# EAGLE design main (EAGLE 5.09)
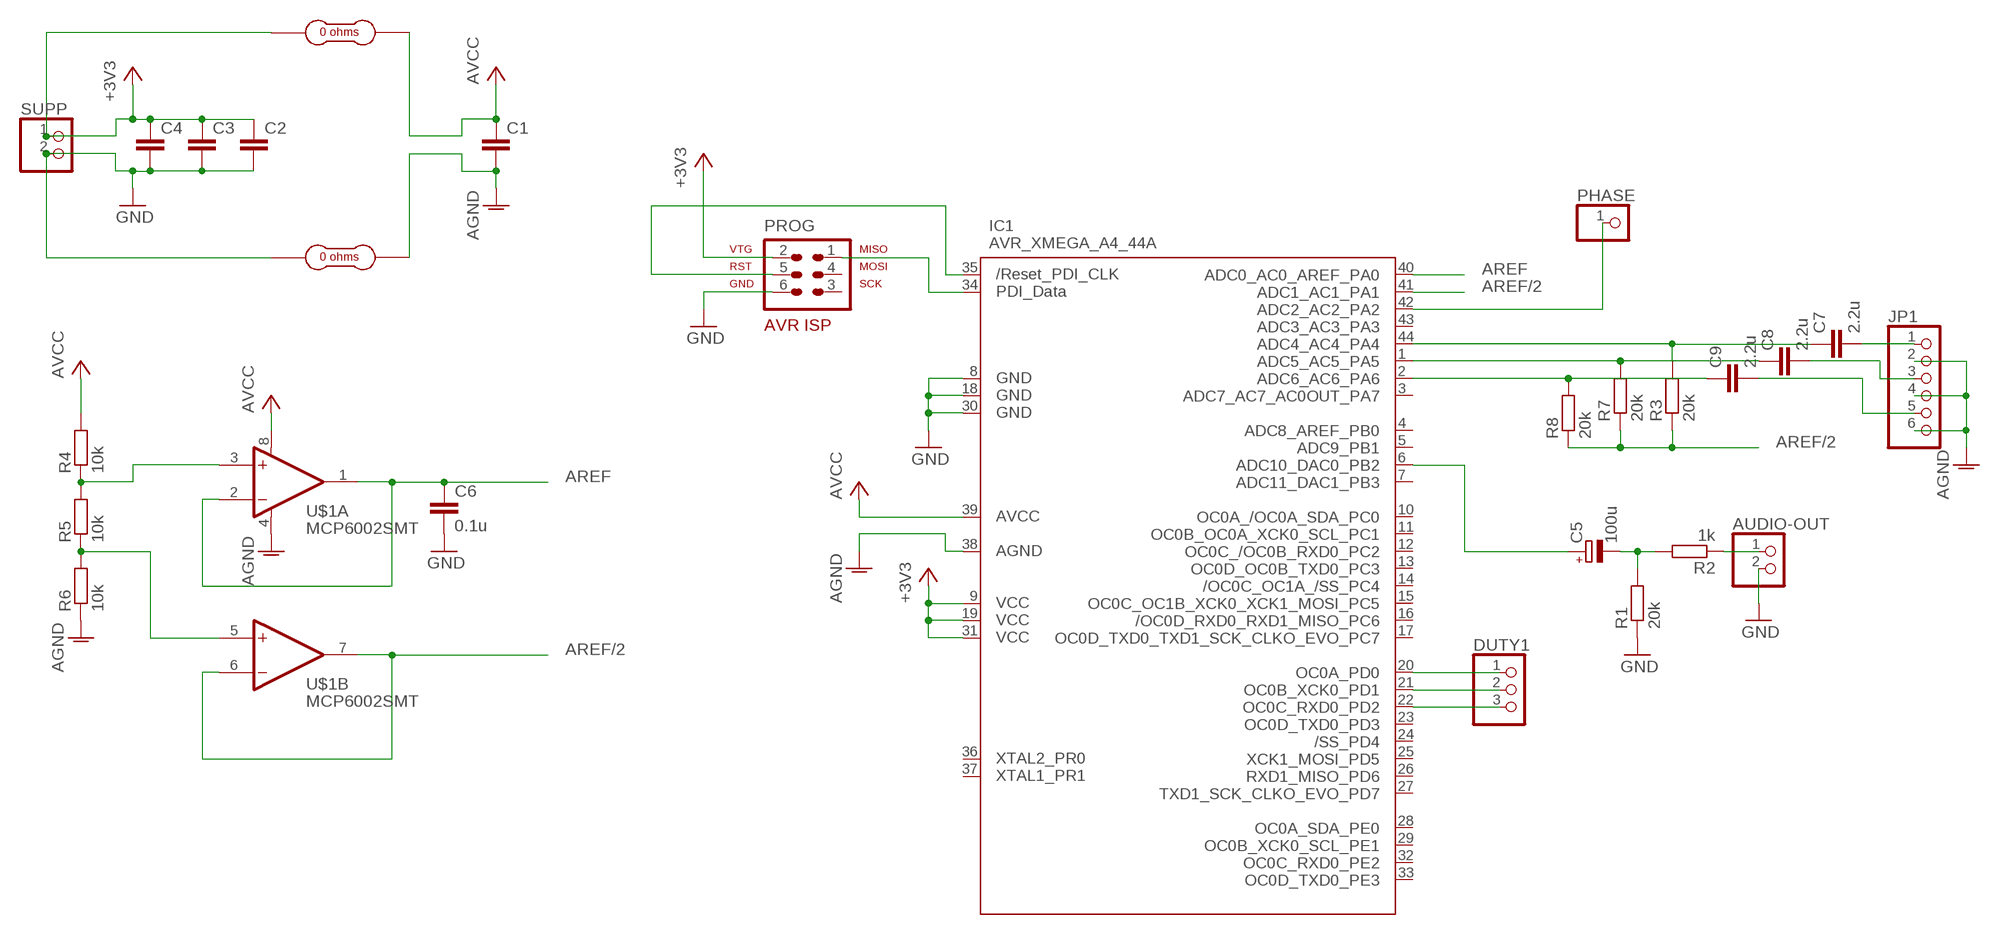
[diagram p0: schematic, sheet 1]

## Parts
AUDIO-OUT  PINHD-1X2  [1X02]
C1  C-EUC0805  [C0805]
C2  C-EUC0805  [C0805]
C3  C-EUC0805  [C0805]
C4  C-EUC0805  [C0805]
C5  100u  CPOL-EUE3.5-8  [E3,5-8]
C6  0.1u  C-EUC0805  [C0805]
C7  2.2u  C-EUC0805  [C0805]
C8  2.2u  C-EUC0805  [C0805]
C9  2.2u  C-EUC0805  [C0805]
DUTY1  PINHD-1X3  [1X03]
IC1  AVR_XMEGA_A4_44A  [TQFP44]
JP1  PINHD-1X6  [1X06]
PHASE  PINHD-1X1  [1X01]
PROG  AVR-ISP-6  [AVR-ISP-6]
R1  20k  R-EU_R0805  [R0805]
R2  1k  R-EU_R0805  [R0805]
R3  20k  R-EU_R0805  [R0805]
R4  10k  R-EU_R0805  [R0805]
R5  10k  R-EU_R0805  [R0805]
R6  10k  R-EU_R0805  [R0805]
R7  20k  R-EU_R0805  [R0805]
R8  20k  R-EU_R0805  [R0805]
SUPP  PINHD-1X2  [1X02]
U$1  MCP6002SMT  [SOIC8]
U$2  RESISTOR-0  [JOINED-PADS]
U$4  RESISTOR-0  [JOINED-PADS]

## Nets
+3V3: C2.1 C3.1 C4.1 IC1.9(VCC1) IC1.19(VCC2) IC1.31(VCC3) PROG.2 SUPP.1 U$2.P$1
AGND: C1.2 IC1.38(AGND) JP1.2 JP1.4 JP1.6 R6.1 U$1.4(A:V-) U$4.P$2
AREF: C6.1 IC1.40(PA0) U$1.1(A:OUT) U$1.2(A:-IN)
AREF/2: IC1.41(PA1) R3.1 R7.1 R8.1 U$1.6(B:-IN) U$1.7(B:OUT)
AVCC: C1.1 IC1.39(AVCC) R4.2 U$1.8(A:V+) U$2.P$2
GND: AUDIO-OUT.2 C2.2 C3.2 C4.2 C6.2 IC1.8(GND1) IC1.18(GND2) IC1.30(GND3) PROG.6 R1.1 SUPP.2 U$4.P$1
IN1: C7.2 JP1.1
N$1: IC1.35(RESET) PROG.5
N$2: C5.+ IC1.6(PB2)
N$3: IC1.34(PDI_DATA) PROG.1
N$4: C5.- R1.2 R2.2
N$5: AUDIO-OUT.1 R2.1
N$6: C7.1 IC1.44(PA4) R3.2
N$8: IC1.42(PA2) PHASE.1
N$10: C8.2 JP1.3
N$11: R4.1 R5.2 U$1.3(A:+IN)
N$12: R5.1 R6.2 U$1.5(B:+IN)
N$13: C9.2 JP1.5
N$14: C8.1 IC1.1(PA5) R7.2
N$15: C9.1 IC1.2(PA6) R8.2
N$18: DUTY1.1 IC1.20(PD0)
N$19: DUTY1.2 IC1.21(PD1)
N$20: DUTY1.3 IC1.22(PD2)
Unconnected: IC1.3(PA7) IC1.4(PB0) IC1.5(PB1) IC1.7(PB3) IC1.10(PC0) IC1.11(PC1) IC1.12(PC2) IC1.13(PC3) IC1.14(PC4) IC1.15(PC5) IC1.16(PC6) IC1.17(PC7) IC1.23(PD3) IC1.24(PD4) IC1.25(PD5) IC1.26(PD6) IC1.27(PD7) IC1.28(PE0) IC1.29(PE1) IC1.32(PE2) IC1.33(PE3) IC1.36(PR0) IC1.37(PR1) IC1.43(PA3) PROG.3 PROG.4

## Library data of the parts
AUDIO-OUT SUPP = pinhead:PINHD-1X2: PIN HEADER
C1-C4 C6-C9 = rcl:C-EU: CAPACITOR, European symbol
C5 = rcl:CPOL-EU: POLARIZED CAPACITOR, European symbol
DUTY1 = pinhead:PINHD-1X3: PIN HEADER
IC1 = xmega:AVR_XMEGA_A4_: Device for Atmel AVR XMEGA A4 Series
JP1 = pinhead:PINHD-1X6: PIN HEADER
PHASE = pinhead:PINHD-1X1: PIN HEADER
PROG = avr-6:AVR-ISP-6: AVR ISP-6 Serial Programming Header
R1-R8 = rcl:R-EU_: RESISTOR, European symbol
U$1 = adam - ics:MCP6002: Dual General Op Amp 1.8V min supply 1MHz (6V/us)
U$2 U$4 = adam - misc:RESISTOR-0

## Net classes
1 fill: clearance 0.762 mm

## Board
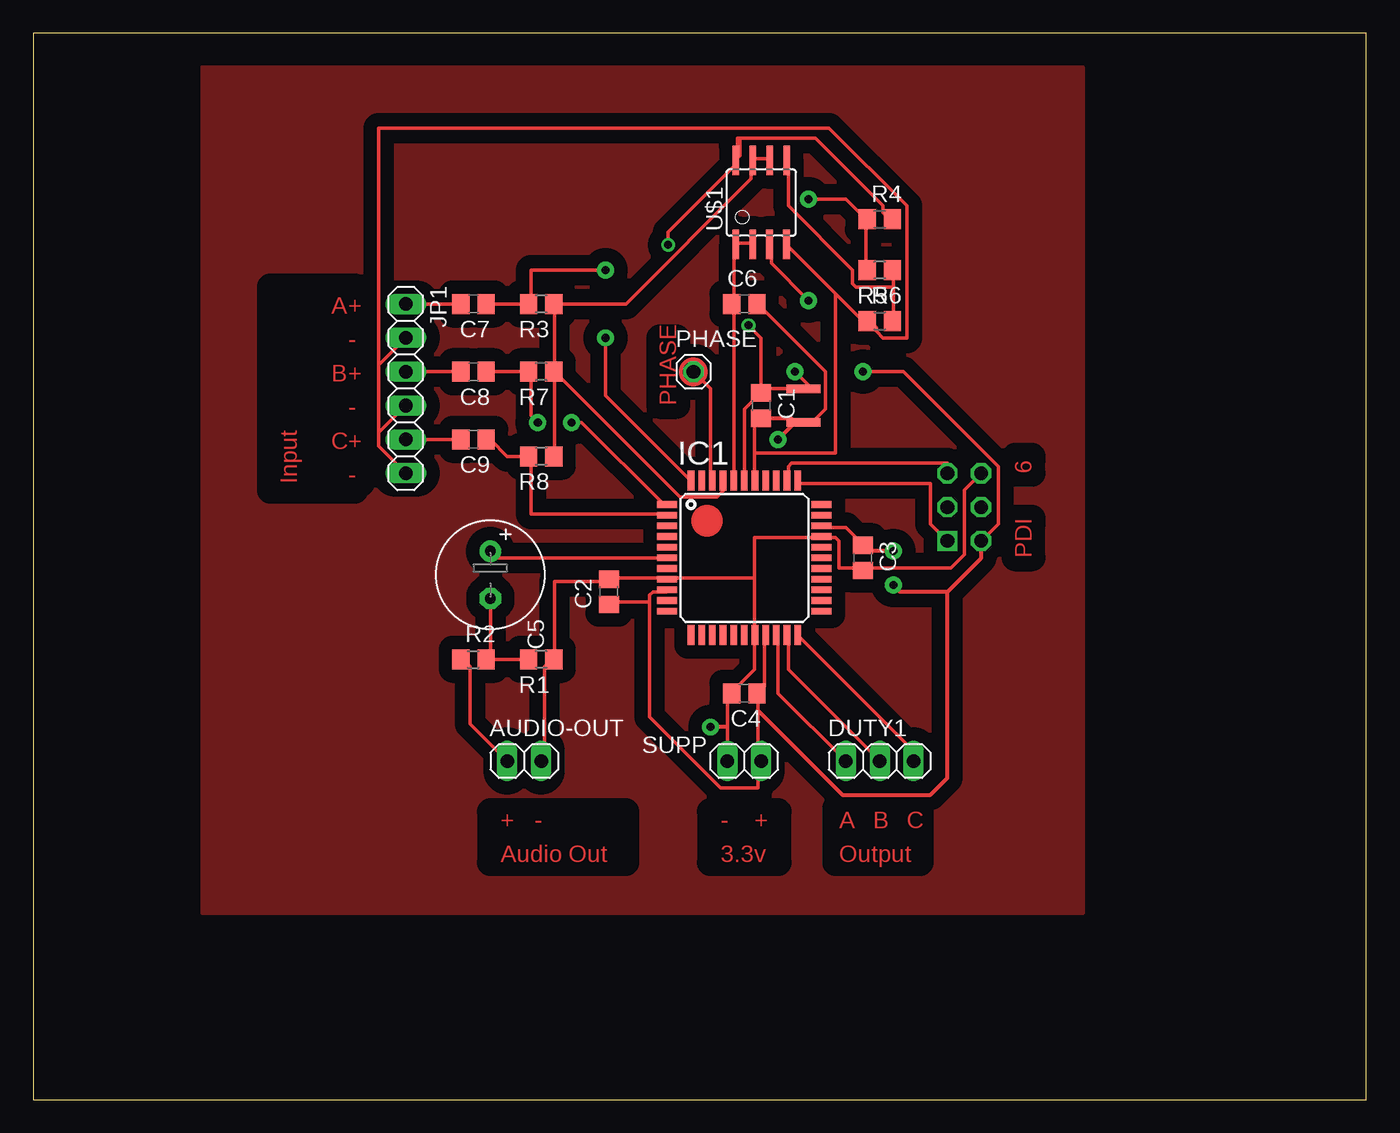
[diagram p1: board, top side]
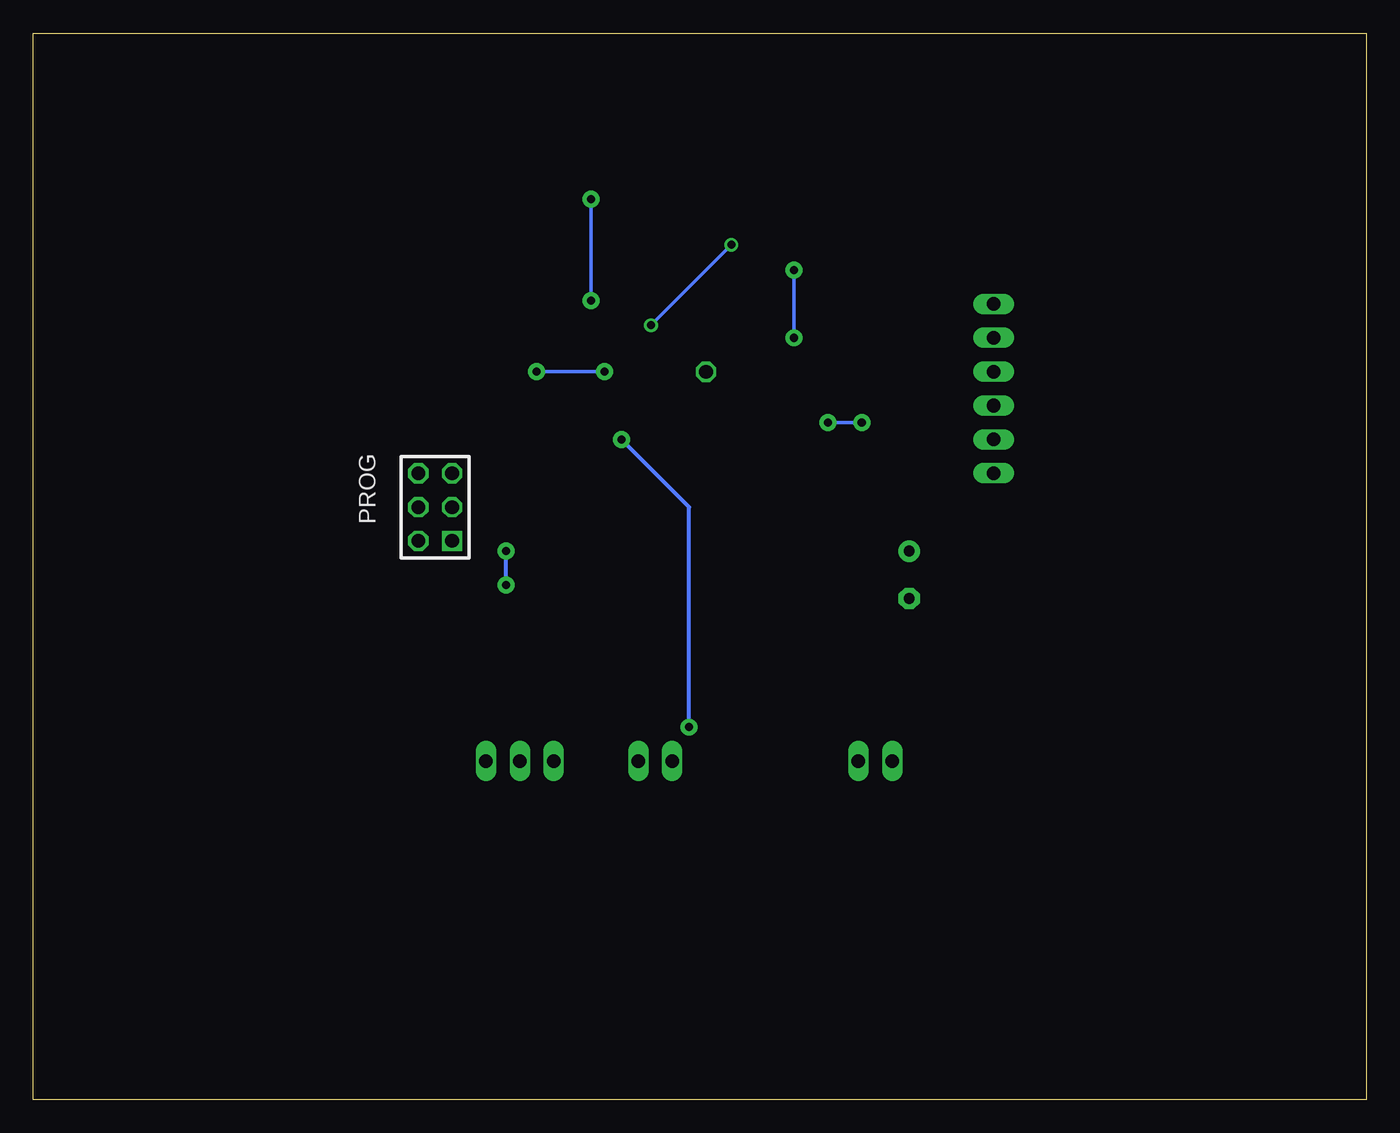
[diagram p2: board, bottom side, seen from below]

Size 100 x 80 mm. Coordinates in mm from the lower left corner, seen from the top.
Outline: 0,0 100,0 100,80 0,80 0,0
Copper layers (1*16): Top 0.035mm / dielectric 1.5mm / Bottom 0.035mm
Design rules "default *": minimum track width 10mil, minimum drill 24mil, track to track 15mil, track to pad 10mil, pad to pad 10mil, via to via 10mil, smd to smd 8mil, copper to edge 40mil, drill to drill 8mil, minimum pad ring 10mil, minimum via ring 8mil, stop-mask expansion 4mil, vias tented up to drill 0mil, thermal gap 10mil
tRestrict: area 34.3,17.8 to 44.5,21.6; area 50.8,17.8 to 55.9,21.6; area 60.2,17.8 to 66.5,21.8; area 17.8,45.7 to 24.1,61; area 47,52.1 to 48.3,57.1; area 73.7,40.6 to 74.9,43.2; area 73.7,47 to 74.9,48.3; area 49.5,36.8 to 57.2,44.5

### Footprints (pad centres in the part's own frame; a part is rotated, then mirrored left to right if it is on the bottom)
1X02 = drill 1.016 long: 1 -1.27,0; 2 1.27,0
C0805 = smd 1.3 x 1.5: 1 -0.95,0; 2 0.95,0
E3,5-8 = drill 0.813 pad 1.6: + -1.778,0 | drill 0.813 pad 1.6 octagon: - 1.778,0
1X03 = drill 1.016 long: 1 -2.54,0; 2 0,0; 3 2.54,0
TQFP44 = smd 1.5 x 0.5: 1 -5.8,4; 2 -5.8,3.2; 3 -5.8,2.4; 4 -5.8,1.6; 5 -5.8,0.8; 6 -5.8,0; 7 -5.8,-0.8; 8 -5.8,-1.6; 9 -5.8,-2.4; 10 -5.8,-3.2; 11 -5.8,-4; 23 5.8,-4; 24 5.8,-3.2; 25 5.8,-2.4; 26 5.8,-1.6; 27 5.8,-0.8; 28 5.8,0; 29 5.8,0.8; 30 5.8,1.6; 31 5.8,2.4; 32 5.8,3.2; 33 5.8,4 | smd 0.5 x 1.5: 12 -4,-5.8; 13 -3.2,-5.8; 14 -2.4,-5.8; 15 -1.6,-5.8; 16 -0.8,-5.8; 17 0,-5.8; 18 0.8,-5.8; 19 1.6,-5.8; 20 2.4,-5.8; 21 3.2,-5.8; 22 4,-5.8; 34 4,5.8; 35 3.2,5.8; 36 2.4,5.8; 37 1.6,5.8; 38 0.8,5.8; 39 0,5.8; 40 -0.8,5.8; 41 -1.6,5.8; 42 -2.4,5.8; 43 -3.2,5.8; 44 -4,5.8
1X06 = drill 1.016 long: 1 -6.35,0; 2 -3.81,0; 3 -1.27,0; 4 1.27,0; 5 3.81,0; 6 6.35,0
1X01 = drill 1.016 octagon: 1 0,0
AVR-ISP-6 = drill 1.016 square: 1 -2.54,-1.27 | drill 1.016 octagon: 2 -2.54,1.27; 3 0,-1.27; 4 0,1.27; 5 2.54,-1.27; 6 2.54,1.27
R0805 = smd 1.3 x 1.5: 1 -0.95,0; 2 0.95,0
SOIC8 = smd 0.5 x 2.2: 1 -1.905,-3.154; 2 -0.645,-3.154; 3 0.625,-3.154; 4 1.895,-3.154; 5 1.905,3.154; 6 0.635,3.154; 7 -0.635,3.154; 8 -1.905,3.154
JOINED-PADS = smd 1.27 x 0.635: P$1 -1.27,0; P$2 0,0

### Placement (x,y rotation side)
AUDIO-OUT  36.83,25.4 0 top
C1  54.61,52.07 270 top
C2  43.18,38.1 90 top
C3  62.23,40.64 270 top
C4  53.34,30.48 180 top
C5  34.29,39.37 270 top
C6  53.34,59.69 0 top
C7  33.02,59.69 180 top
C8  33.02,54.61 180 top
C9  33.02,49.53 180 top
DUTY1  63.5,25.4 0 top
IC1  53.34,40.64 0 top
JP1  27.94,53.34 270 top
PHASE  49.53,54.61 0 top
PROG  69.85,44.45 90 bottom
R1  38.1,33.02 180 top
R2  33.02,33.02 0 top
R3  38.1,59.69 180 top
R4  63.5,66.04 0 top
R5  63.5,62.23 180 top
R6  63.5,58.42 0 top
R7  38.1,54.61 180 top
R8  38.1,48.26 180 top
SUPP  53.34,25.4 180 top
U$1  54.61,67.31 0 top
U$2  57.15,53.34 180 top
U$4  57.15,50.8 180 top

### Tracks (layer width: path | path; a pad name or v marks a point on that pad's centre or on a via)
+3V3  (via drill 0.6 pad 1.27, 0.61 pad 1.27)
  Top 0.254: IC1.31 59.18,42.93 60.96,42.93 62.23,41.66 C3.1 62.23,41.4 | 46.23,37.34 43.18,37.34 C2.1 | 46.23,37.34 46.23,37.85 46.48,38.1 47.5,38.1 IC1.9 | v57.15,54.61 U$2.P$1 | v62.23,54.61 65.28,54.61 72.39,47.5 72.39,43.18 PROG.2 | 54.36,30.48 54.86,30.99 54.86,34.8 IC1.19 | 54.36,25.65 54.36,29.21 54.36,30.48 | 54.36,30.48 C4.1 | 46.23,37.34 46.23,28.7 51.56,23.37 54.36,23.37 54.36,25.65 | 54.36,25.65 SUPP.1
  Top 0.305: PROG.2 71.12,40.64 68.58,38.1 | 68.58,38.1 68.58,24.13 67.31,22.86 60.71,22.86 54.36,29.21 | 62.23,41.4 62.23,41.15 v64.52,41.15 | v64.52,38.61 65.02,38.1 68.58,38.1
  Bottom 0.254: v62.23,54.61 v57.15,54.61
  Bottom 0.305: v64.52,38.61 v64.52,41.15
AGND
  Top 0.254: JP1.6 25.91,49.02 25.91,50.04 | 25.91,50.04 JP1.4 | 25.91,55.12 JP1.2 | 25.91,50.04 25.91,55.12 | 25.91,55.12 25.91,72.9 59.69,72.9 65.53,67.06 65.53,57.15 63.75,57.15 63.25,57.66 63.25,57.91 62.74,58.42 R6.1 62.23,58.42 60.2,60.45 | 54.1,48.51 54.1,50.55 54.61,51.05 C1.2 | 54.1,48.51 54.1,46.48 IC1.38 | 60.2,60.45 56.64,64.01 U$1.4 | 54.1,48.51 60.2,48.51 60.2,60.45
  Top 0.305: U$4.P$2 56.83,51.12 C1.2
AREF
  Top 0.254: U$1.2 53.85,64.26 52.83,64.26 U$1.1 52.58,64.01 52.58,59.69 | 52.58,59.69 52.58,46.48 IC1.40 | 52.58,59.69 C6.1
AREF/2
  Top 0.254: U$1.6 55.12,70.61 54.1,70.61 U$1.7 53.85,70.36 53.85,69.09 44.45,59.69 39.12,59.69 | 39.12,54.61 48.51,45.21 51.31,45.21 51.82,45.72 51.82,46.23 IC1.41 | 39.12,54.61 39.12,49.53 R8.1 | 39.12,54.61 39.12,59.69 | 39.12,54.61 R7.1 | 39.12,59.69 R3.1
AVCC  (via drill 0.61)
  Top 0.254: 54.61,53.34 U$2.P$2 | 54.61,53.09 54.61,53.34 | 54.61,53.09 53.34,51.82 IC1.39 | 54.61,53.09 C1.1 54.61,53.09 | 53.02,72.14 52.83,72.14 52.83,70.61 | 53.02,72.14 58.67,72.14 63.75,67.06 63.75,66.55 64.26,66.04 R4.2 | 53.02,72.14 53.02,70.8 52.7,70.48 U$1.8 52.7,70.17 47.62,65.09 v47.62,64.14 | v53.66,58.1 54.61,57.15 54.61,53.34
  Bottom 0.254: v53.66,58.1 v47.62,64.14
GND  (via drill 0.6 pad 1.27)
  Top 0.254: SUPP.2 52.07,27.94 52.07,30.23 52.32,30.48 C4.2 52.58,30.48 52.58,30.73 54.1,32.26 54.1,34.8 IC1.18 54.1,35.05 54.1,39.12 | AUDIO-OUT.2 38.35,25.65 38.35,32.51 38.86,33.02 R1.1 39.12,33.02 39.12,38.86 43.18,38.86 C2.2 43.18,39.12 47.5,39.12 IC1.8 47.75,39.12 54.1,39.12 | 62.23,39.88 60.45,39.88 60.45,41.91 60.2,42.16 59.18,42.16 IC1.30 58.93,42.16 54.1,42.16 54.1,39.12 | U$4.P$1 59.44,51.82 59.44,54.61 54.36,59.69 C6.2 | PROG.6 69.85,45.72 69.85,40.89 68.83,39.88 62.23,39.88 | 62.23,39.88 C3.2
  Top 0.305: U$4.P$1 57.15,50.8 v55.88,49.53 | 52.07,27.94 v50.8,27.94
  Bottom 0.305: v55.88,49.53 50.8,44.45 v50.8,27.94
IN1
  Top 0.254: JP1.1 C7.2
N$1
  Top 0.254: PROG.5 68.58,47.75 56.9,47.75 56.64,47.5 56.64,46.48 IC1.35
N$2
  Top 0.254: C5.+ 34.29,40.64 IC1.6
N$3
  Top 0.254: PROG.1 67.31,43.18 67.31,46.23 57.4,46.23 IC1.34
N$4
  Top 0.254: 34.29,33.02 R2.2 34.04,33.02 | 34.29,33.02 R1.2 | 34.29,33.02 C5.-
N$5
  Top 0.254: AUDIO-OUT.1 32.77,28.19 32.77,32.51 32.26,33.02 R2.1
N$6  (via drill 0.61 pad 1.27)
  Top 0.254: C7.1 R3.2 37.34,59.69 37.34,62.23 v42.93,62.23 | v42.93,57.15 42.93,52.83 49.28,46.48 IC1.44
  Bottom 0.254: v42.93,62.23 v42.93,57.15
N$7
  pour Top (isolate 1.016): 12.7,77.47 78.74,77.47 78.74,13.97 12.7,13.97
N$8
  Top 0.254: PHASE.1 50.8,53.34 50.8,46.48 IC1.42
N$10
  Top 0.254: JP1.3 C8.2
N$11  (via drill 0.61 pad 1.27)
  Top 0.254: 62.48,66.04 62.48,62.23 R5.2 | v58.17,59.94 55.37,62.74 55.37,64.26 U$1.3 | v58.17,67.56 60.96,67.56 62.48,66.04 | 62.48,66.04 R4.1
  Bottom 0.254: v58.17,59.94 v58.17,67.56
N$12
  Top 0.254: 64.52,60.96 64.52,62.23 R5.1 | 64.52,60.96 64.52,58.42 R6.2 | 64.52,60.96 61.72,60.96 61.47,61.21 61.47,62.23 56.64,67.06 56.64,70.36 U$1.5
N$13
  Top 0.254: JP1.5 C9.2
N$14  (via drill 0.61 pad 1.27)
  Top 0.254: C8.1 R7.2 37.34,54.61 37.34,51.31 v37.85,50.8 | v40.39,50.8 41.15,50.8 47.24,44.7 IC1.1
  Bottom 0.254: v37.85,50.8 v40.39,50.8
N$15
  Top 0.254: C9.1 34.29,49.53 35.56,48.26 R8.2 37.34,48.26 37.34,43.94 47.5,43.94 IC1.2
N$18
  Top 0.254: DUTY1.1 55.88,30.48 55.88,34.8 IC1.20
N$19
  Top 0.254: DUTY1.2 56.64,32.26 56.64,34.8 IC1.21
N$20
  Top 0.254: DUTY1.3 66.04,26.16 57.4,34.8 IC1.22
(copper drawn outside any net)
  shapes: Top circle x2

### Text on the board
Top: A | + | - | B | + | PHASE | - | C | + | 6 | Input | - | PDI | + | - | - | + | A | B | C | Audio Out | 3.3v | Output